# EAGLE schematic AudioStream_v2 (EAGLE 7.7.0)
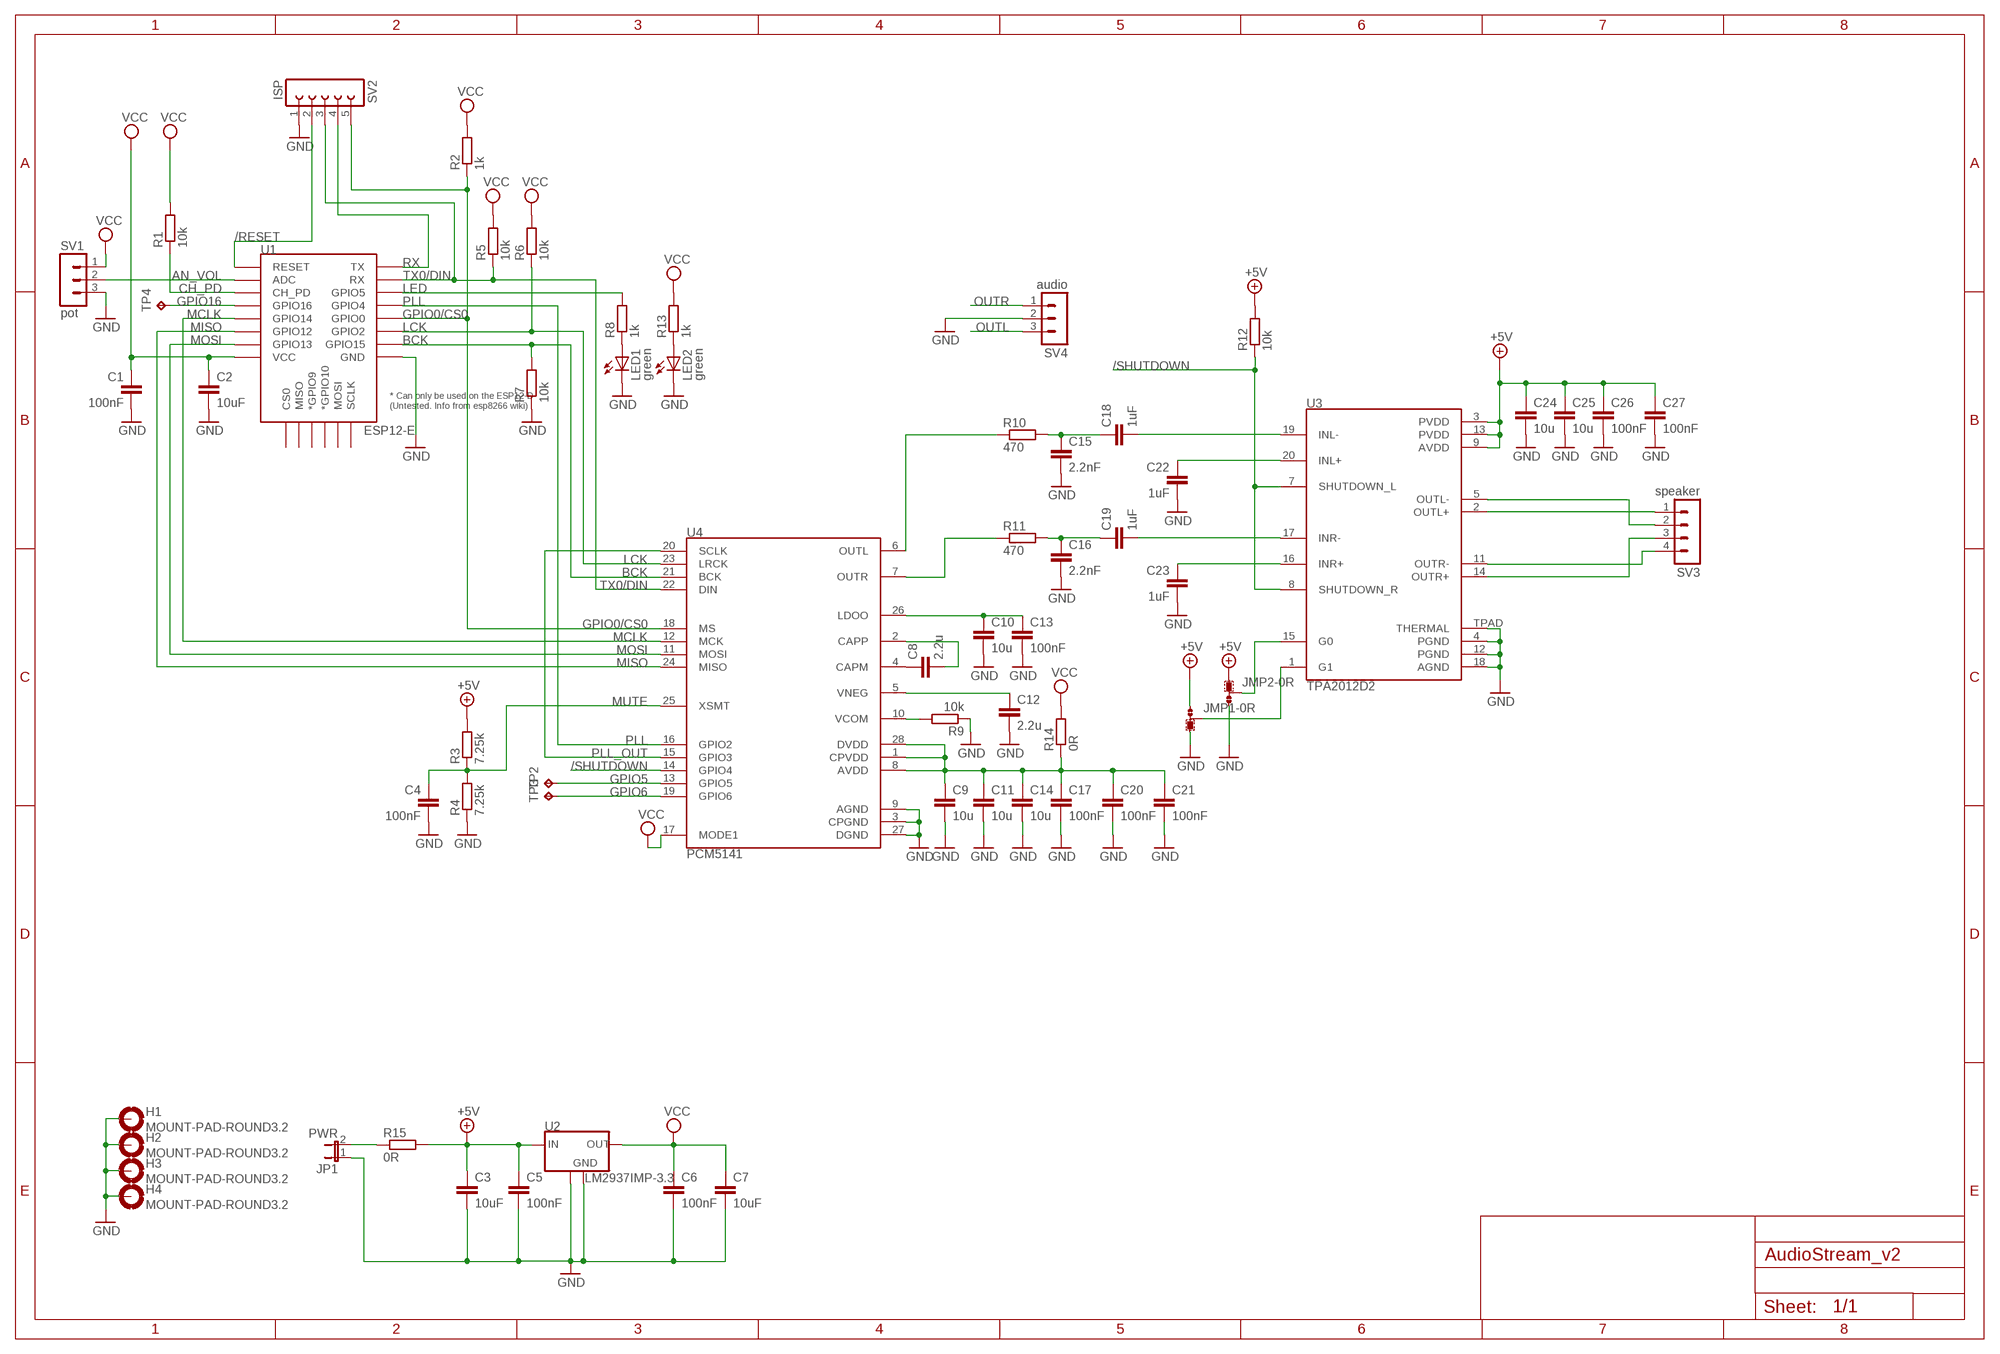
[diagram p0: schematic, sheet 1]

## Parts
C1  100nF  C-EUC0805  [C0805]
C2  10uF  C-EUC1210  [C1210]
C3  10uF  C-EUC3216  [C3216]
C4  100nF  C-EUC0603  [C0603]
C5  100nF  C-EUC0805  [C0805]
C6  100nF  C-EUC0805  [C0805]
C7  10uF  C-EUC3216  [C3216]
C8  2.2u  C-EUC0805  [C0805]
C9  10u  C-EUC3216  [C3216]
C10  10u  C-EUC3216  [C3216]
C11  10u  C-EUC3216  [C3216]
C12  2.2u  C-EUC0805  [C0805]
C13  100nF  C-EUC0805  [C0805]
C14  10u  C-EUC3216  [C3216]
C15  2.2nF  C-EUC0603  [C0603]
C16  2.2nF  C-EUC0603  [C0603]
C17  100nF  C-EUC0805  [C0805]
C18  1uF  C-EUC0805  [C0805]
C19  1uF  C-EUC0805  [C0805]
C20  100nF  C-EUC0805  [C0805]
C21  100nF  C-EUC0805  [C0805]
C22  1uF  C-EUC0805  [C0805]
C23  1uF  C-EUC0805  [C0805]
C24  10u  C-EUC3216  [C3216]
C25  10u  C-EUC3216  [C3216]
C26  100nF  C-EUC0805  [C0805]
C27  100nF  C-EUC0805  [C0805]
H1  MOUNT-PAD-ROUND3.2  [3,2-PAD]
H2  MOUNT-PAD-ROUND3.2  [3,2-PAD]
H3  MOUNT-PAD-ROUND3.2  [3,2-PAD]
H4  MOUNT-PAD-ROUND3.2  [3,2-PAD]
JMP1  0R-JUMPA  [A0R-JMP]
JMP2  0R-JUMPA  [A0R-JMP]
JP1  PWR  JP1E  [JP1]
LED1  green  LEDCHIPLED_0805  [CHIPLED_0805]
LED2  green  LEDCHIPLED_0805  [CHIPLED_0805]
R1  10k  R-EU_R0603  [R0603]
R2  1k  R-EU_R0603  [R0603]
R3  7.25k  R-EU_R0603  [R0603]
R4  7.25k  R-EU_R0603  [R0603]
R5  10k  R-EU_R0603  [R0603]
R6  10k  R-EU_R0603  [R0603]
R7  10k  R-EU_R0603  [R0603]
R8  1k  R-EU_R0603  [R0603]
R9  10k  R-EU_R0603  [R0603]
R10  470  R-EU_R0603  [R0603]
R11  470  R-EU_R0603  [R0603]
R12  10k  R-EU_R0603  [R0603]
R13  1k  R-EU_R0603  [R0603]
R14  0R  R-EU_R0805  [R0805]
R15  0R  R-EU_R0805  [R0805]
SV1  pot  MA03-1  [MA03-1]
SV2  ISP  FE05-1  [FE05-1]
SV3  speaker  MA04-1  [MA04-1]
SV4  audio  MA03-1  [MA03-1]
TP2  TPTP10R  [TP10R]
TP3  TPTP10R  [TP10R]
TP4  TPTP10R  [TP10R]
U1  ESP12-E  ESP12ESMD  [ESP12E-SMD]
U2  LM2937IMP-3.3  LM2937IMP-X.X  [SOT223]
U3  TPA2012D2  [QFN50P400X400X100-21N]
U4  PCM5141  [PW_R-PDSO-G28]

## Nets
+5V: C3.1 C5.1 C24.1 C25.1 C26.1 C27.1 JMP1.1 JMP2.1 R3.2 R12.2 R15.2 U2.1(IN) U3.3(PVDD) U3.9(AVDD) U3.13(PVDD)
/RESET: SV2.2 U1.RESET
/SHUTDOWN: R12.1 U3.7(SHUTDOWN_L) U3.8(SHUTDOWN_R) U4.14(GPIO4)
AN_VOL: SV1.2 U1.ADC
BCK: R7.2 U1.GPIO15 U4.21(BCK)
CAPM: C8.1 U4.4(CAPM)
CAPP: C8.2 U4.2(CAPP)
CH_PD: R1.1 U1.CH_PD
CPVDD: C9.1 C11.1 C14.1 C17.1 C20.1 C21.1 R14.1 U4.1(CPVDD) U4.8(AVDD) U4.28(DVDD)
G0: JMP2.2 U3.15(G0)
G1: JMP1.2 U3.1(G1)
GND: C1.2 C2.2 C3.2 C4.2 C5.2 C6.2 C7.2 C9.2 C10.2 C11.2 C12.2 C13.2 C14.2 C15.2 C16.2 C17.2 C20.2 C21.2 C22.2 C23.2 C24.2 C25.2 C26.2 C27.2 H1.B3,2(MOUNT) H2.B3,2(MOUNT) H3.B3,2(MOUNT) H4.B3,2(MOUNT) JMP1.3 JMP2.3 JP1.1 LED1.C LED2.C R4.1 R7.1 R9.1 SV1.3 SV2.1 SV4.2 U1.GND U2.2(GND) U2.4(GND) U3.4(PGND) U3.12(PGND) U3.18(AGND) U3.TPAD(THERMAL) U4.3(CPGND) U4.9(AGND) U4.27(DGND)
GPIO0/CS0: R2.1 SV2.5 U1.GPIO0 U4.18(MS)
GPIO5: TP2.TP U4.13(GPIO5)
GPIO6: TP3.TP U4.19(GPIO6)
GPIO16: TP4.TP U1.GPIO16
INL+: C22.1 U3.20(INL+)
INL-: C18.2 U3.19(INL-)
INR+: C23.1 U3.16(INR+)
INR-: C19.2 U3.17(INR-)
LCK: R6.1 U1.GPIO2 U4.23(LRCK)
LDOO: C10.1 C13.1 U4.26(LDOO)
LED: R8.2 U1.GPIO5
LED1_R1: LED1.A R8.1
LED1_R2: LED2.A R13.1
MCLK: U1.GPIO14 U4.12(MCK)
MISO: U1.GPIO12 U4.24(MISO)
MOSI: U1.GPIO13 U4.11(MOSI)
MUTE: C4.1 R3.1 R4.2 U4.25(XSMT)
OUTL: C15.1 C18.1 R10.2 SV4.3
OUTL+: SV3.1 U3.2(OUTL+)
OUTL-: SV3.2 U3.5(OUTL-)
OUTL_IC: R10.1 U4.6(OUTL)
OUTR: C16.1 C19.1 R11.2 SV4.1
OUTR+: SV3.3 U3.14(OUTR+)
OUTR-: SV3.4 U3.11(OUTR-)
OUTR_IC: R11.1 U4.7(OUTR)
PLL: U1.GPIO4 U4.16(GPIO2)
PLL_OUT: U4.15(GPIO3) U4.20(SCLK)
RX: SV2.4 U1.TXD0(TX)
TX0/DIN: R5.1 SV2.3 U1.RXD0(RX) U4.22(DIN)
VCC: C1.1 C2.1 C6.1 C7.1 R1.2 R2.2 R5.2 R6.2 R13.2 R14.2 SV1.1 U1.VCC U2.3(OUT) U4.17(MODE1)
VCOM: R9.2 U4.10(VCOM)
VIN: JP1.2 R15.1
VNEG: C12.1 U4.5(VNEG)
Unconnected: U1.CS0 U1.GPIO9(*GPIO9) U1.GPIO10(*GPIO10) U1.MISO U1.MOSI U1.SCLK

## Library data of the parts
C1-C27 = rcl:C-EU: CAPACITOR, European symbol
H1-H4 = holes:MOUNT-PAD-ROUND: MOUNTING PAD, round
JMP1 JMP2 = jump-0r-smd:0R-JUMP: SMD 0R 0805 Jumper
JP1 = jumper:JP1E: JUMPER
LED1 LED2 = led:LED: LED OSRAM: - CHIPLED LG R971, LG N971, LY N971, LG Q971, LY Q971, LO R971, LY R971 LH N974, LH R974 LS Q976, LO Q976, LY Q976 LO Q996 - Hyper CHIPLED LW Q18S LB Q993, LB Q99A, LB R99A - SideLED LS A670, LO A670, LY A670, LG A670, LP A670 LB A673, LV A673, LT A673, LW A673 LH A674 LY A675 LS A676, LA A676, LO A676, LY A676, LW A676 LS A679, LY A679, LG A679 - Hyper Micro SIDELED® LS Y876, LA Y876, LO Y876, LY Y876 LT Y87S - SmartLED LW L88C, LW L88S LB L89C, LB L89S, LG L890 LS L89K, LO L89K, LY L89K LS L896, LA L896, LO L896, LY L896 - TOPLED LS T670, LO T670, LY T670, LG T670, LP T670 LSG T670, LSP T670, LSY T670, LOP T670, LYG T670 LG T671, LOG T671, LSG T671 LB T673, LV T673, LT T673, LW T673 LH T674 LS T676, LA T676, LO T676, LY T676, LB T676, LH T676, LSB T676, LW T676 LB T67C, LV T67C, LT T67C, LS T67K, LO T67K, LY T67K, LW E67C LS E67B, LA E67B, LO E67B, LY E67B, LB E67C, LV E67C, LT E67C LW T67C LS T679, LY T679, LG T679 LS T770, LO T770, LY T770, LG T770, LP T770 LB T773, LV T773, LT T773, LW T773 LH T774 LS E675, LA E675, LY E675, LS T675 LS T776, LA T776, LO T776, LY T776, LB T776 LHGB T686 LT T68C, LB T68C - Hyper Mini TOPLED® LB M676 - Mini TOPLED Santana® LG M470 LS M47K, LO M47K, LY M47K Source: http://www.osram.convergy.de LUXEON: - LUMILED® LXK2-PW12-R00, LXK2-PW12-S00, LXK2-PW14-U00, LXK2-PW14-V00 LXK2-PM12-R00, LXK2-PM12-S00, LXK2-PM14-U00 LXK2-PE12-Q00, LXK2-PE12-R00, LXK2-PE12-S00, LXK2-PE14-T00, LXK2-PE14-U00 LXK2-PB12-K00, LXK2-PB12-L00, LXK2-PB12-M00, LXK2-PB14-N00, LXK2-PB14-P00, LXK2-PB14-Q00 LXK2-PR12-L00, LXK2-PR12-M00, LXK2-PR14-Q00, LXK2-PR14-R00 LXK2-PD12-Q00, LXK2-PD12-R00, LXK2-PD12-S00 LXK2-PH12-R00, LXK2-PH12-S00 LXK2-PL12-P00, LXK2-PL12-Q00, LXK2-PL12-R00 Source: www.luxeon.com KINGBRIGHT: KA-3528ASYC Source: www.kingbright.com
R1-R15 = rcl:R-EU_: RESISTOR, European symbol
SV1 SV4 = con-lstb:MA03-1: PIN HEADER; OC_FARNELL: unknown; OC_NEWARK: unknown
SV2 = con-lsta:FE05-1: FEMALE HEADER; OC_FARNELL: unknown; OC_NEWARK: unknown
SV3 = con-lstb:MA04-1: PIN HEADER; OC_FARNELL: unknown; OC_NEWARK: unknown
TP2-TP4 = testpad:TP: Test pad
U1 = AudioStream:ESP12E: ESP12E Module
U2 = AudioStream:LM2937IMP-X.X
U3 = AudioStream:TPA2012D2
U4 = AudioStream:PCM5141

## Net classes
0 default: clearance 0.152 mm